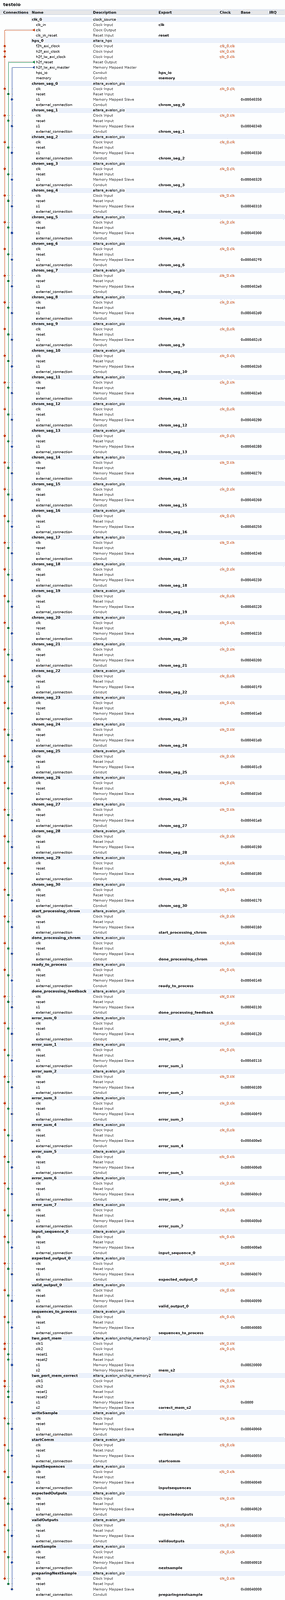
[diagram p0: system contents, whole]
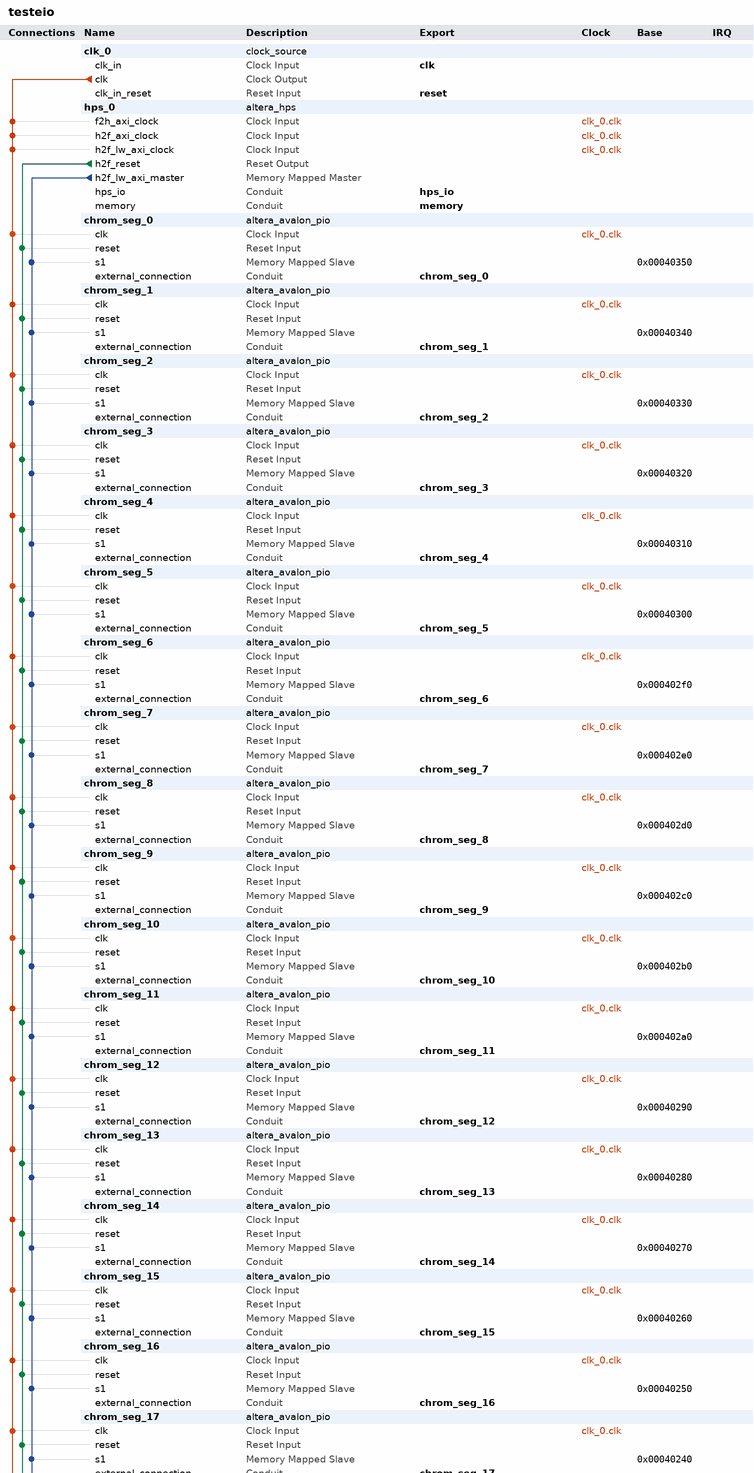
[diagram p1: system contents, upper part]
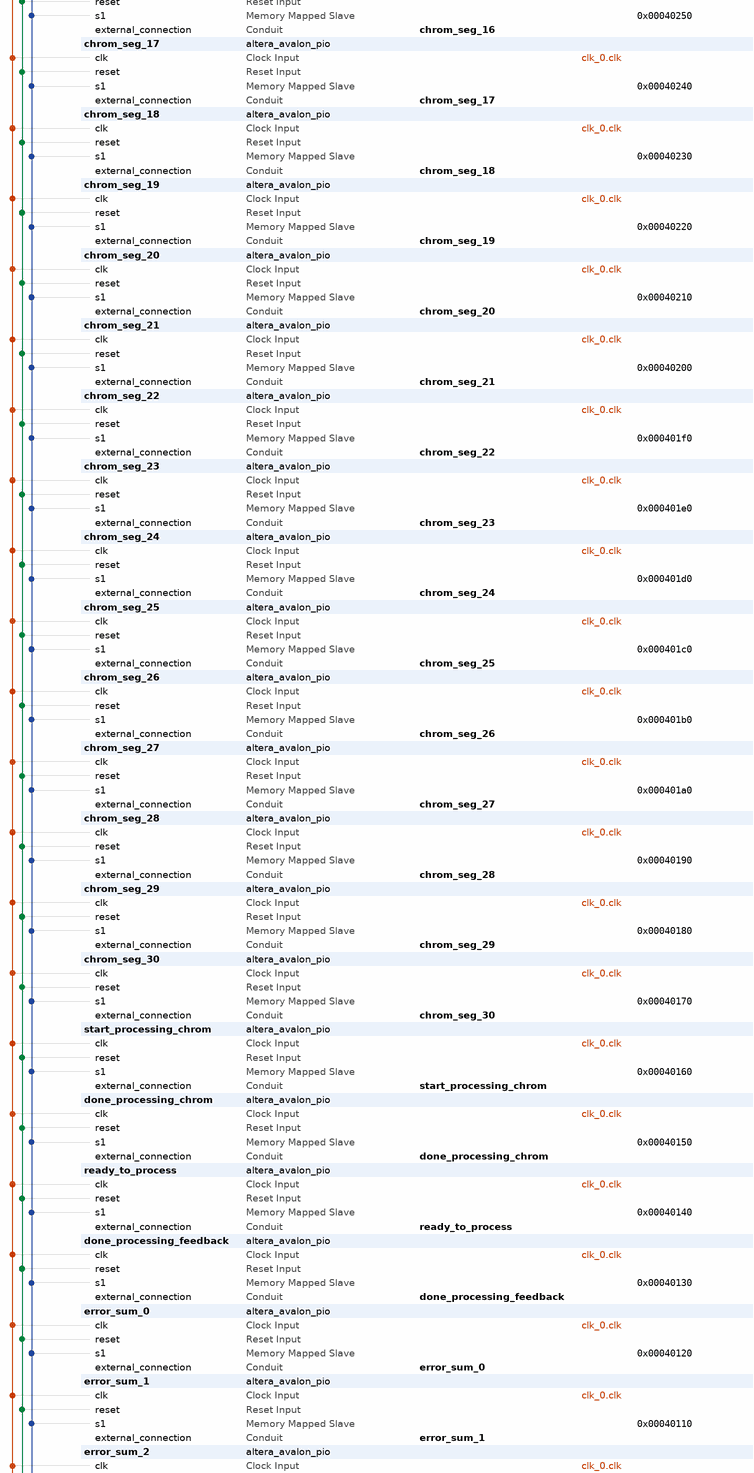
[diagram p2: system contents, middle part]
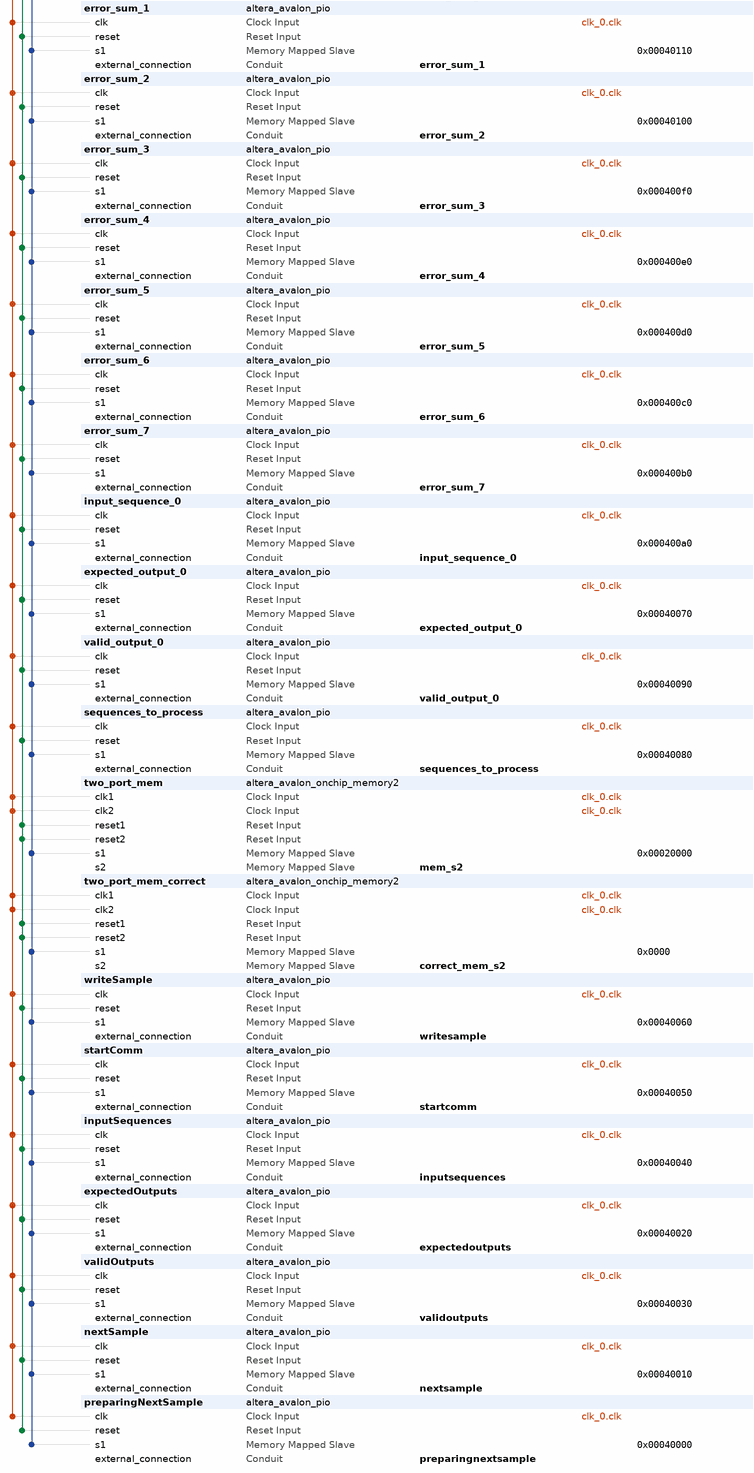
[diagram p3: system contents, lower part]
# Platform Designer (Qsys) system testeio, Cyclone V 5CSEMA5F31C6
# Parameters at their usual value, and those the tool derives, are not listed.
package require -exact qsys 16.1
create_system testeio
set_project_property DEVICE_FAMILY {Cyclone V}
set_project_property DEVICE 5CSEMA5F31C6

add_instance clk_0 clock_source 16.1
set_instance_parameter_value clk_0 clockFrequency 50000000

add_instance hps_0 altera_hps 16.1
set_instance_parameter_value hps_0 EMAC1_Mode RGMII
set_instance_parameter_value hps_0 EMAC1_PinMuxing {HPS I/O Set 0}
set_instance_parameter_value hps_0 F2SCLK_COLDRST_Enable false
set_instance_parameter_value hps_0 F2SCLK_DBGRST_Enable false
set_instance_parameter_value hps_0 F2SCLK_WARMRST_Enable false
set_instance_parameter_value hps_0 F2SINTERRUPT_Enable false
set_instance_parameter_value hps_0 F2S_Width 2
set_instance_parameter_value hps_0 FPGA_PERIPHERAL_OUTPUT_CLOCK_FREQ_EMAC0_GTX_CLK 125
set_instance_parameter_value hps_0 FPGA_PERIPHERAL_OUTPUT_CLOCK_FREQ_EMAC0_MD_CLK 2.5
set_instance_parameter_value hps_0 FPGA_PERIPHERAL_OUTPUT_CLOCK_FREQ_EMAC1_GTX_CLK 125
set_instance_parameter_value hps_0 FPGA_PERIPHERAL_OUTPUT_CLOCK_FREQ_EMAC1_MD_CLK 2.5
set_instance_parameter_value hps_0 HPS_PROTOCOL DDR3
set_instance_parameter_value hps_0 I2C0_Mode N/A
set_instance_parameter_value hps_0 I2C0_PinMuxing Unused
set_instance_parameter_value hps_0 I2C1_Mode N/A
set_instance_parameter_value hps_0 I2C1_PinMuxing Unused
set_instance_parameter_value hps_0 LWH2F_Enable true
set_instance_parameter_value hps_0 MEM_BANKADDR_WIDTH 3
set_instance_parameter_value hps_0 MEM_CLK_FREQ 400.0
set_instance_parameter_value hps_0 MEM_COL_ADDR_WIDTH 10
set_instance_parameter_value hps_0 MEM_DQ_WIDTH 32
set_instance_parameter_value hps_0 MEM_DRV_STR RZQ/7
set_instance_parameter_value hps_0 MEM_ROW_ADDR_WIDTH 15
set_instance_parameter_value hps_0 MEM_RTT_NOM RZQ/4
set_instance_parameter_value hps_0 MEM_RTT_WR {Dynamic ODT off}
set_instance_parameter_value hps_0 MEM_TCL 11
set_instance_parameter_value hps_0 MEM_TFAW_NS 30.0
set_instance_parameter_value hps_0 MEM_TRAS_NS 35.0
set_instance_parameter_value hps_0 MEM_TRCD_NS 13.75
set_instance_parameter_value hps_0 MEM_TRFC_NS 260.0
set_instance_parameter_value hps_0 MEM_TRP_NS 13.75
set_instance_parameter_value hps_0 MEM_VENDOR JEDEC
set_instance_parameter_value hps_0 MEM_WTCL 8
set_instance_parameter_value hps_0 QSPI_Mode N/A
set_instance_parameter_value hps_0 QSPI_PinMuxing Unused
set_instance_parameter_value hps_0 REF_CLK_FREQ 25.0
set_instance_parameter_value hps_0 S2FCLK_USER2CLK 5
set_instance_parameter_value hps_0 S2F_Width 2
set_instance_parameter_value hps_0 SDIO_Mode {4-bit Data}
set_instance_parameter_value hps_0 SDIO_PinMuxing {HPS I/O Set 0}
set_instance_parameter_value hps_0 SPIM1_Mode N/A
set_instance_parameter_value hps_0 SPIM1_PinMuxing Unused
set_instance_parameter_value hps_0 STM_Enable false
set_instance_parameter_value hps_0 TIMING_BOARD_AC_SKEW 0.03
set_instance_parameter_value hps_0 TIMING_BOARD_AC_TO_CK_SKEW 0.0
set_instance_parameter_value hps_0 TIMING_BOARD_DQ_TO_DQS_SKEW 0.0
set_instance_parameter_value hps_0 TIMING_BOARD_MAX_CK_DELAY 0.03
set_instance_parameter_value hps_0 TIMING_BOARD_MAX_DQS_DELAY 0.02
set_instance_parameter_value hps_0 TIMING_BOARD_SKEW_BETWEEN_DQS 0.08
set_instance_parameter_value hps_0 TIMING_BOARD_SKEW_CKDQS_DIMM_MAX 0.16
set_instance_parameter_value hps_0 TIMING_BOARD_SKEW_CKDQS_DIMM_MIN 0.09
set_instance_parameter_value hps_0 TIMING_BOARD_SKEW_WITHIN_DQS 0.01
set_instance_parameter_value hps_0 TIMING_TDH 65
set_instance_parameter_value hps_0 TIMING_TDQSCK 255
set_instance_parameter_value hps_0 TIMING_TDQSQ 125
set_instance_parameter_value hps_0 TIMING_TDS 30
set_instance_parameter_value hps_0 TIMING_TIH 140
set_instance_parameter_value hps_0 TIMING_TIS 180
set_instance_parameter_value hps_0 TIMING_TQSH 0.4
set_instance_parameter_value hps_0 UART0_Mode {No Flow Control}
set_instance_parameter_value hps_0 UART0_PinMuxing {HPS I/O Set 0}
set_instance_parameter_value hps_0 USB1_Mode SDR
set_instance_parameter_value hps_0 USB1_PinMuxing {HPS I/O Set 0}
set_instance_parameter_value hps_0 desired_cfg_clk_mhz 100.0
set_instance_parameter_value hps_0 desired_qspi_clk_mhz 400.0

add_instance chrom_seg_0 altera_avalon_pio 16.1
set_instance_parameter_value chrom_seg_0 direction Output
set_instance_parameter_value chrom_seg_0 width 32

add_instance chrom_seg_1 altera_avalon_pio 16.1
set_instance_parameter_value chrom_seg_1 direction Output
set_instance_parameter_value chrom_seg_1 width 32

add_instance chrom_seg_2 altera_avalon_pio 16.1
set_instance_parameter_value chrom_seg_2 direction Output
set_instance_parameter_value chrom_seg_2 width 32

add_instance chrom_seg_3 altera_avalon_pio 16.1
set_instance_parameter_value chrom_seg_3 direction Output
set_instance_parameter_value chrom_seg_3 width 32

add_instance chrom_seg_4 altera_avalon_pio 16.1
set_instance_parameter_value chrom_seg_4 direction Output
set_instance_parameter_value chrom_seg_4 width 32

add_instance chrom_seg_5 altera_avalon_pio 16.1
set_instance_parameter_value chrom_seg_5 direction Output
set_instance_parameter_value chrom_seg_5 width 32

add_instance chrom_seg_6 altera_avalon_pio 16.1
set_instance_parameter_value chrom_seg_6 direction Output
set_instance_parameter_value chrom_seg_6 width 32

add_instance chrom_seg_7 altera_avalon_pio 16.1
set_instance_parameter_value chrom_seg_7 direction Output
set_instance_parameter_value chrom_seg_7 width 32

add_instance chrom_seg_8 altera_avalon_pio 16.1
set_instance_parameter_value chrom_seg_8 direction Output
set_instance_parameter_value chrom_seg_8 width 32

add_instance chrom_seg_9 altera_avalon_pio 16.1
set_instance_parameter_value chrom_seg_9 direction Output
set_instance_parameter_value chrom_seg_9 width 32

add_instance chrom_seg_10 altera_avalon_pio 16.1
set_instance_parameter_value chrom_seg_10 direction Output
set_instance_parameter_value chrom_seg_10 width 32

add_instance chrom_seg_11 altera_avalon_pio 16.1
set_instance_parameter_value chrom_seg_11 direction Output
set_instance_parameter_value chrom_seg_11 width 32

add_instance chrom_seg_12 altera_avalon_pio 16.1
set_instance_parameter_value chrom_seg_12 direction Output
set_instance_parameter_value chrom_seg_12 width 32

add_instance chrom_seg_13 altera_avalon_pio 16.1
set_instance_parameter_value chrom_seg_13 direction Output
set_instance_parameter_value chrom_seg_13 width 32

add_instance chrom_seg_14 altera_avalon_pio 16.1
set_instance_parameter_value chrom_seg_14 direction Output
set_instance_parameter_value chrom_seg_14 width 32

add_instance chrom_seg_15 altera_avalon_pio 16.1
set_instance_parameter_value chrom_seg_15 direction Output
set_instance_parameter_value chrom_seg_15 width 32

add_instance chrom_seg_16 altera_avalon_pio 16.1
set_instance_parameter_value chrom_seg_16 direction Output
set_instance_parameter_value chrom_seg_16 width 32

add_instance chrom_seg_17 altera_avalon_pio 16.1
set_instance_parameter_value chrom_seg_17 direction Output
set_instance_parameter_value chrom_seg_17 width 32

add_instance chrom_seg_18 altera_avalon_pio 16.1
set_instance_parameter_value chrom_seg_18 direction Output
set_instance_parameter_value chrom_seg_18 width 32

add_instance chrom_seg_19 altera_avalon_pio 16.1
set_instance_parameter_value chrom_seg_19 direction Output
set_instance_parameter_value chrom_seg_19 width 32

add_instance chrom_seg_20 altera_avalon_pio 16.1
set_instance_parameter_value chrom_seg_20 direction Output
set_instance_parameter_value chrom_seg_20 width 32

add_instance chrom_seg_21 altera_avalon_pio 16.1
set_instance_parameter_value chrom_seg_21 direction Output
set_instance_parameter_value chrom_seg_21 width 32

add_instance chrom_seg_22 altera_avalon_pio 16.1
set_instance_parameter_value chrom_seg_22 direction Output
set_instance_parameter_value chrom_seg_22 width 32

add_instance chrom_seg_23 altera_avalon_pio 16.1
set_instance_parameter_value chrom_seg_23 direction Output
set_instance_parameter_value chrom_seg_23 width 32

add_instance chrom_seg_24 altera_avalon_pio 16.1
set_instance_parameter_value chrom_seg_24 direction Output
set_instance_parameter_value chrom_seg_24 width 32

add_instance chrom_seg_25 altera_avalon_pio 16.1
set_instance_parameter_value chrom_seg_25 direction Output
set_instance_parameter_value chrom_seg_25 width 32

add_instance chrom_seg_26 altera_avalon_pio 16.1
set_instance_parameter_value chrom_seg_26 direction Output
set_instance_parameter_value chrom_seg_26 width 32

add_instance chrom_seg_27 altera_avalon_pio 16.1
set_instance_parameter_value chrom_seg_27 direction Output
set_instance_parameter_value chrom_seg_27 width 32

add_instance chrom_seg_28 altera_avalon_pio 16.1
set_instance_parameter_value chrom_seg_28 direction Output
set_instance_parameter_value chrom_seg_28 width 32

add_instance chrom_seg_29 altera_avalon_pio 16.1
set_instance_parameter_value chrom_seg_29 direction Output
set_instance_parameter_value chrom_seg_29 width 32

add_instance chrom_seg_30 altera_avalon_pio 16.1
set_instance_parameter_value chrom_seg_30 direction Output
set_instance_parameter_value chrom_seg_30 width 32

add_instance start_processing_chrom altera_avalon_pio 16.1
set_instance_parameter_value start_processing_chrom direction Output
set_instance_parameter_value start_processing_chrom width 1

add_instance done_processing_chrom altera_avalon_pio 16.1
set_instance_parameter_value done_processing_chrom direction Input
set_instance_parameter_value done_processing_chrom width 1

add_instance ready_to_process altera_avalon_pio 16.1
set_instance_parameter_value ready_to_process direction Input
set_instance_parameter_value ready_to_process width 1

add_instance done_processing_feedback altera_avalon_pio 16.1
set_instance_parameter_value done_processing_feedback direction Output
set_instance_parameter_value done_processing_feedback width 1

add_instance error_sum_0 altera_avalon_pio 16.1
set_instance_parameter_value error_sum_0 direction Input
set_instance_parameter_value error_sum_0 width 32

add_instance error_sum_1 altera_avalon_pio 16.1
set_instance_parameter_value error_sum_1 direction Input
set_instance_parameter_value error_sum_1 width 32

add_instance error_sum_2 altera_avalon_pio 16.1
set_instance_parameter_value error_sum_2 direction Input
set_instance_parameter_value error_sum_2 width 32

add_instance error_sum_3 altera_avalon_pio 16.1
set_instance_parameter_value error_sum_3 direction Input
set_instance_parameter_value error_sum_3 width 32

add_instance error_sum_4 altera_avalon_pio 16.1
set_instance_parameter_value error_sum_4 direction Input
set_instance_parameter_value error_sum_4 width 32

add_instance error_sum_5 altera_avalon_pio 16.1
set_instance_parameter_value error_sum_5 direction Input
set_instance_parameter_value error_sum_5 width 32

add_instance error_sum_6 altera_avalon_pio 16.1
set_instance_parameter_value error_sum_6 direction Input
set_instance_parameter_value error_sum_6 width 32

add_instance error_sum_7 altera_avalon_pio 16.1
set_instance_parameter_value error_sum_7 direction Input
set_instance_parameter_value error_sum_7 width 32

add_instance input_sequence_0 altera_avalon_pio 16.1
set_instance_parameter_value input_sequence_0 direction Output
set_instance_parameter_value input_sequence_0 width 32

add_instance expected_output_0 altera_avalon_pio 16.1
set_instance_parameter_value expected_output_0 direction Output
set_instance_parameter_value expected_output_0 width 32

add_instance valid_output_0 altera_avalon_pio 16.1
set_instance_parameter_value valid_output_0 direction Output
set_instance_parameter_value valid_output_0 width 32

add_instance sequences_to_process altera_avalon_pio 16.1
set_instance_parameter_value sequences_to_process direction Output
set_instance_parameter_value sequences_to_process width 32

add_instance two_port_mem altera_avalon_onchip_memory2 16.1
set_instance_parameter_value two_port_mem dataWidth 32
set_instance_parameter_value two_port_mem dualPort true
set_instance_parameter_value two_port_mem initMemContent true
set_instance_parameter_value two_port_mem initializationFileName onchip_mem.hex
set_instance_parameter_value two_port_mem memorySize 131072

add_instance two_port_mem_correct altera_avalon_onchip_memory2 16.1
set_instance_parameter_value two_port_mem_correct dataWidth 32
set_instance_parameter_value two_port_mem_correct dualPort true
set_instance_parameter_value two_port_mem_correct initMemContent true
set_instance_parameter_value two_port_mem_correct initializationFileName onchip_mem.hex
set_instance_parameter_value two_port_mem_correct memorySize 131072

add_instance writeSample altera_avalon_pio 16.1
set_instance_parameter_value writeSample direction Output
set_instance_parameter_value writeSample width 32

add_instance startComm altera_avalon_pio 16.1
set_instance_parameter_value startComm direction Output
set_instance_parameter_value startComm width 32

add_instance inputSequences altera_avalon_pio 16.1
set_instance_parameter_value inputSequences direction Input
set_instance_parameter_value inputSequences width 32

add_instance expectedOutputs altera_avalon_pio 16.1
set_instance_parameter_value expectedOutputs direction Input
set_instance_parameter_value expectedOutputs width 32

add_instance validOutputs altera_avalon_pio 16.1
set_instance_parameter_value validOutputs direction Input
set_instance_parameter_value validOutputs width 32

add_instance nextSample altera_avalon_pio 16.1
set_instance_parameter_value nextSample direction Input
set_instance_parameter_value nextSample width 32

add_instance preparingNextSample altera_avalon_pio 16.1
set_instance_parameter_value preparingNextSample direction Output
set_instance_parameter_value preparingNextSample width 32

# connections
add_connection clk_0.clk chrom_seg_0.clk clock
add_connection clk_0.clk chrom_seg_1.clk clock
add_connection clk_0.clk chrom_seg_2.clk clock
add_connection clk_0.clk chrom_seg_3.clk clock
add_connection clk_0.clk chrom_seg_4.clk clock
add_connection clk_0.clk chrom_seg_5.clk clock
add_connection clk_0.clk chrom_seg_6.clk clock
add_connection clk_0.clk chrom_seg_7.clk clock
add_connection clk_0.clk chrom_seg_8.clk clock
add_connection clk_0.clk chrom_seg_9.clk clock
add_connection clk_0.clk chrom_seg_10.clk clock
add_connection clk_0.clk chrom_seg_11.clk clock
add_connection clk_0.clk chrom_seg_12.clk clock
add_connection clk_0.clk chrom_seg_13.clk clock
add_connection clk_0.clk chrom_seg_14.clk clock
add_connection clk_0.clk chrom_seg_15.clk clock
add_connection clk_0.clk chrom_seg_16.clk clock
add_connection clk_0.clk chrom_seg_17.clk clock
add_connection clk_0.clk chrom_seg_18.clk clock
add_connection clk_0.clk chrom_seg_19.clk clock
add_connection clk_0.clk chrom_seg_20.clk clock
add_connection clk_0.clk chrom_seg_21.clk clock
add_connection clk_0.clk chrom_seg_22.clk clock
add_connection clk_0.clk chrom_seg_23.clk clock
add_connection clk_0.clk chrom_seg_24.clk clock
add_connection clk_0.clk chrom_seg_25.clk clock
add_connection clk_0.clk chrom_seg_26.clk clock
add_connection clk_0.clk chrom_seg_27.clk clock
add_connection clk_0.clk chrom_seg_28.clk clock
add_connection clk_0.clk chrom_seg_29.clk clock
add_connection clk_0.clk chrom_seg_30.clk clock
add_connection clk_0.clk done_processing_chrom.clk clock
add_connection clk_0.clk done_processing_feedback.clk clock
add_connection clk_0.clk error_sum_0.clk clock
add_connection clk_0.clk error_sum_1.clk clock
add_connection clk_0.clk error_sum_2.clk clock
add_connection clk_0.clk error_sum_3.clk clock
add_connection clk_0.clk error_sum_4.clk clock
add_connection clk_0.clk error_sum_5.clk clock
add_connection clk_0.clk error_sum_6.clk clock
add_connection clk_0.clk error_sum_7.clk clock
add_connection clk_0.clk expected_output_0.clk clock
add_connection clk_0.clk expectedOutputs.clk clock
add_connection clk_0.clk hps_0.f2h_axi_clock clock
add_connection clk_0.clk hps_0.h2f_axi_clock clock
add_connection clk_0.clk hps_0.h2f_lw_axi_clock clock
add_connection clk_0.clk input_sequence_0.clk clock
add_connection clk_0.clk inputSequences.clk clock
add_connection clk_0.clk nextSample.clk clock
add_connection clk_0.clk preparingNextSample.clk clock
add_connection clk_0.clk ready_to_process.clk clock
add_connection clk_0.clk sequences_to_process.clk clock
add_connection clk_0.clk start_processing_chrom.clk clock
add_connection clk_0.clk startComm.clk clock
add_connection clk_0.clk two_port_mem.clk1 clock
add_connection clk_0.clk two_port_mem.clk2 clock
add_connection clk_0.clk two_port_mem_correct.clk1 clock
add_connection clk_0.clk two_port_mem_correct.clk2 clock
add_connection clk_0.clk valid_output_0.clk clock
add_connection clk_0.clk validOutputs.clk clock
add_connection clk_0.clk writeSample.clk clock
add_connection hps_0.h2f_reset chrom_seg_0.reset reset
add_connection hps_0.h2f_reset chrom_seg_1.reset reset
add_connection hps_0.h2f_reset chrom_seg_2.reset reset
add_connection hps_0.h2f_reset chrom_seg_3.reset reset
add_connection hps_0.h2f_reset chrom_seg_4.reset reset
add_connection hps_0.h2f_reset chrom_seg_5.reset reset
add_connection hps_0.h2f_reset chrom_seg_6.reset reset
add_connection hps_0.h2f_reset chrom_seg_7.reset reset
add_connection hps_0.h2f_reset chrom_seg_8.reset reset
add_connection hps_0.h2f_reset chrom_seg_9.reset reset
add_connection hps_0.h2f_reset chrom_seg_10.reset reset
add_connection hps_0.h2f_reset chrom_seg_11.reset reset
add_connection hps_0.h2f_reset chrom_seg_12.reset reset
add_connection hps_0.h2f_reset chrom_seg_13.reset reset
add_connection hps_0.h2f_reset chrom_seg_14.reset reset
add_connection hps_0.h2f_reset chrom_seg_15.reset reset
add_connection hps_0.h2f_reset chrom_seg_16.reset reset
add_connection hps_0.h2f_reset chrom_seg_17.reset reset
add_connection hps_0.h2f_reset chrom_seg_18.reset reset
add_connection hps_0.h2f_reset chrom_seg_19.reset reset
add_connection hps_0.h2f_reset chrom_seg_20.reset reset
add_connection hps_0.h2f_reset chrom_seg_21.reset reset
add_connection hps_0.h2f_reset chrom_seg_22.reset reset
add_connection hps_0.h2f_reset chrom_seg_23.reset reset
add_connection hps_0.h2f_reset chrom_seg_24.reset reset
add_connection hps_0.h2f_reset chrom_seg_25.reset reset
add_connection hps_0.h2f_reset chrom_seg_26.reset reset
add_connection hps_0.h2f_reset chrom_seg_27.reset reset
add_connection hps_0.h2f_reset chrom_seg_28.reset reset
add_connection hps_0.h2f_reset chrom_seg_29.reset reset
add_connection hps_0.h2f_reset chrom_seg_30.reset reset
add_connection hps_0.h2f_reset done_processing_chrom.reset reset
add_connection hps_0.h2f_reset done_processing_feedback.reset reset
add_connection hps_0.h2f_reset error_sum_0.reset reset
add_connection hps_0.h2f_reset error_sum_1.reset reset
add_connection hps_0.h2f_reset error_sum_2.reset reset
add_connection hps_0.h2f_reset error_sum_3.reset reset
add_connection hps_0.h2f_reset error_sum_4.reset reset
add_connection hps_0.h2f_reset error_sum_5.reset reset
add_connection hps_0.h2f_reset error_sum_6.reset reset
add_connection hps_0.h2f_reset error_sum_7.reset reset
add_connection hps_0.h2f_reset expected_output_0.reset reset
add_connection hps_0.h2f_reset expectedOutputs.reset reset
add_connection hps_0.h2f_reset input_sequence_0.reset reset
add_connection hps_0.h2f_reset inputSequences.reset reset
add_connection hps_0.h2f_reset nextSample.reset reset
add_connection hps_0.h2f_reset preparingNextSample.reset reset
add_connection hps_0.h2f_reset ready_to_process.reset reset
add_connection hps_0.h2f_reset sequences_to_process.reset reset
add_connection hps_0.h2f_reset start_processing_chrom.reset reset
add_connection hps_0.h2f_reset startComm.reset reset
add_connection hps_0.h2f_reset two_port_mem.reset1 reset
add_connection hps_0.h2f_reset two_port_mem.reset2 reset
add_connection hps_0.h2f_reset two_port_mem_correct.reset1 reset
add_connection hps_0.h2f_reset two_port_mem_correct.reset2 reset
add_connection hps_0.h2f_reset valid_output_0.reset reset
add_connection hps_0.h2f_reset validOutputs.reset reset
add_connection hps_0.h2f_reset writeSample.reset reset
add_connection hps_0.h2f_lw_axi_master chrom_seg_0.s1 avalon
set_connection_parameter_value hps_0.h2f_lw_axi_master/chrom_seg_0.s1 baseAddress 0x00040350
add_connection hps_0.h2f_lw_axi_master chrom_seg_1.s1 avalon
set_connection_parameter_value hps_0.h2f_lw_axi_master/chrom_seg_1.s1 baseAddress 0x00040340
add_connection hps_0.h2f_lw_axi_master chrom_seg_2.s1 avalon
set_connection_parameter_value hps_0.h2f_lw_axi_master/chrom_seg_2.s1 baseAddress 0x00040330
add_connection hps_0.h2f_lw_axi_master chrom_seg_3.s1 avalon
set_connection_parameter_value hps_0.h2f_lw_axi_master/chrom_seg_3.s1 baseAddress 0x00040320
add_connection hps_0.h2f_lw_axi_master chrom_seg_4.s1 avalon
set_connection_parameter_value hps_0.h2f_lw_axi_master/chrom_seg_4.s1 baseAddress 0x00040310
add_connection hps_0.h2f_lw_axi_master chrom_seg_5.s1 avalon
set_connection_parameter_value hps_0.h2f_lw_axi_master/chrom_seg_5.s1 baseAddress 0x00040300
add_connection hps_0.h2f_lw_axi_master chrom_seg_6.s1 avalon
set_connection_parameter_value hps_0.h2f_lw_axi_master/chrom_seg_6.s1 baseAddress 0x000402f0
add_connection hps_0.h2f_lw_axi_master chrom_seg_7.s1 avalon
set_connection_parameter_value hps_0.h2f_lw_axi_master/chrom_seg_7.s1 baseAddress 0x000402e0
add_connection hps_0.h2f_lw_axi_master chrom_seg_8.s1 avalon
set_connection_parameter_value hps_0.h2f_lw_axi_master/chrom_seg_8.s1 baseAddress 0x000402d0
add_connection hps_0.h2f_lw_axi_master chrom_seg_9.s1 avalon
set_connection_parameter_value hps_0.h2f_lw_axi_master/chrom_seg_9.s1 baseAddress 0x000402c0
add_connection hps_0.h2f_lw_axi_master chrom_seg_10.s1 avalon
set_connection_parameter_value hps_0.h2f_lw_axi_master/chrom_seg_10.s1 baseAddress 0x000402b0
add_connection hps_0.h2f_lw_axi_master chrom_seg_11.s1 avalon
set_connection_parameter_value hps_0.h2f_lw_axi_master/chrom_seg_11.s1 baseAddress 0x000402a0
add_connection hps_0.h2f_lw_axi_master chrom_seg_12.s1 avalon
set_connection_parameter_value hps_0.h2f_lw_axi_master/chrom_seg_12.s1 baseAddress 0x00040290
add_connection hps_0.h2f_lw_axi_master chrom_seg_13.s1 avalon
set_connection_parameter_value hps_0.h2f_lw_axi_master/chrom_seg_13.s1 baseAddress 0x00040280
add_connection hps_0.h2f_lw_axi_master chrom_seg_14.s1 avalon
set_connection_parameter_value hps_0.h2f_lw_axi_master/chrom_seg_14.s1 baseAddress 0x00040270
add_connection hps_0.h2f_lw_axi_master chrom_seg_15.s1 avalon
set_connection_parameter_value hps_0.h2f_lw_axi_master/chrom_seg_15.s1 baseAddress 0x00040260
add_connection hps_0.h2f_lw_axi_master chrom_seg_16.s1 avalon
set_connection_parameter_value hps_0.h2f_lw_axi_master/chrom_seg_16.s1 baseAddress 0x00040250
add_connection hps_0.h2f_lw_axi_master chrom_seg_17.s1 avalon
set_connection_parameter_value hps_0.h2f_lw_axi_master/chrom_seg_17.s1 baseAddress 0x00040240
add_connection hps_0.h2f_lw_axi_master chrom_seg_18.s1 avalon
set_connection_parameter_value hps_0.h2f_lw_axi_master/chrom_seg_18.s1 baseAddress 0x00040230
add_connection hps_0.h2f_lw_axi_master chrom_seg_19.s1 avalon
set_connection_parameter_value hps_0.h2f_lw_axi_master/chrom_seg_19.s1 baseAddress 0x00040220
add_connection hps_0.h2f_lw_axi_master chrom_seg_20.s1 avalon
set_connection_parameter_value hps_0.h2f_lw_axi_master/chrom_seg_20.s1 baseAddress 0x00040210
add_connection hps_0.h2f_lw_axi_master chrom_seg_21.s1 avalon
set_connection_parameter_value hps_0.h2f_lw_axi_master/chrom_seg_21.s1 baseAddress 0x00040200
add_connection hps_0.h2f_lw_axi_master chrom_seg_22.s1 avalon
set_connection_parameter_value hps_0.h2f_lw_axi_master/chrom_seg_22.s1 baseAddress 0x000401f0
add_connection hps_0.h2f_lw_axi_master chrom_seg_23.s1 avalon
set_connection_parameter_value hps_0.h2f_lw_axi_master/chrom_seg_23.s1 baseAddress 0x000401e0
add_connection hps_0.h2f_lw_axi_master chrom_seg_24.s1 avalon
set_connection_parameter_value hps_0.h2f_lw_axi_master/chrom_seg_24.s1 baseAddress 0x000401d0
add_connection hps_0.h2f_lw_axi_master chrom_seg_25.s1 avalon
set_connection_parameter_value hps_0.h2f_lw_axi_master/chrom_seg_25.s1 baseAddress 0x000401c0
add_connection hps_0.h2f_lw_axi_master chrom_seg_26.s1 avalon
set_connection_parameter_value hps_0.h2f_lw_axi_master/chrom_seg_26.s1 baseAddress 0x000401b0
add_connection hps_0.h2f_lw_axi_master chrom_seg_27.s1 avalon
set_connection_parameter_value hps_0.h2f_lw_axi_master/chrom_seg_27.s1 baseAddress 0x000401a0
add_connection hps_0.h2f_lw_axi_master chrom_seg_28.s1 avalon
set_connection_parameter_value hps_0.h2f_lw_axi_master/chrom_seg_28.s1 baseAddress 0x00040190
add_connection hps_0.h2f_lw_axi_master chrom_seg_29.s1 avalon
set_connection_parameter_value hps_0.h2f_lw_axi_master/chrom_seg_29.s1 baseAddress 0x00040180
add_connection hps_0.h2f_lw_axi_master chrom_seg_30.s1 avalon
set_connection_parameter_value hps_0.h2f_lw_axi_master/chrom_seg_30.s1 baseAddress 0x00040170
add_connection hps_0.h2f_lw_axi_master done_processing_chrom.s1 avalon
set_connection_parameter_value hps_0.h2f_lw_axi_master/done_processing_chrom.s1 baseAddress 0x00040150
add_connection hps_0.h2f_lw_axi_master done_processing_feedback.s1 avalon
set_connection_parameter_value hps_0.h2f_lw_axi_master/done_processing_feedback.s1 baseAddress 0x00040130
add_connection hps_0.h2f_lw_axi_master error_sum_0.s1 avalon
set_connection_parameter_value hps_0.h2f_lw_axi_master/error_sum_0.s1 baseAddress 0x00040120
add_connection hps_0.h2f_lw_axi_master error_sum_1.s1 avalon
set_connection_parameter_value hps_0.h2f_lw_axi_master/error_sum_1.s1 baseAddress 0x00040110
add_connection hps_0.h2f_lw_axi_master error_sum_2.s1 avalon
set_connection_parameter_value hps_0.h2f_lw_axi_master/error_sum_2.s1 baseAddress 0x00040100
add_connection hps_0.h2f_lw_axi_master error_sum_3.s1 avalon
set_connection_parameter_value hps_0.h2f_lw_axi_master/error_sum_3.s1 baseAddress 0x000400f0
add_connection hps_0.h2f_lw_axi_master error_sum_4.s1 avalon
set_connection_parameter_value hps_0.h2f_lw_axi_master/error_sum_4.s1 baseAddress 0x000400e0
add_connection hps_0.h2f_lw_axi_master error_sum_5.s1 avalon
set_connection_parameter_value hps_0.h2f_lw_axi_master/error_sum_5.s1 baseAddress 0x000400d0
add_connection hps_0.h2f_lw_axi_master error_sum_6.s1 avalon
set_connection_parameter_value hps_0.h2f_lw_axi_master/error_sum_6.s1 baseAddress 0x000400c0
add_connection hps_0.h2f_lw_axi_master error_sum_7.s1 avalon
set_connection_parameter_value hps_0.h2f_lw_axi_master/error_sum_7.s1 baseAddress 0x000400b0
add_connection hps_0.h2f_lw_axi_master expected_output_0.s1 avalon
set_connection_parameter_value hps_0.h2f_lw_axi_master/expected_output_0.s1 baseAddress 0x00040070
add_connection hps_0.h2f_lw_axi_master expectedOutputs.s1 avalon
set_connection_parameter_value hps_0.h2f_lw_axi_master/expectedOutputs.s1 baseAddress 0x00040020
add_connection hps_0.h2f_lw_axi_master input_sequence_0.s1 avalon
set_connection_parameter_value hps_0.h2f_lw_axi_master/input_sequence_0.s1 baseAddress 0x000400a0
add_connection hps_0.h2f_lw_axi_master inputSequences.s1 avalon
set_connection_parameter_value hps_0.h2f_lw_axi_master/inputSequences.s1 baseAddress 0x00040040
add_connection hps_0.h2f_lw_axi_master nextSample.s1 avalon
set_connection_parameter_value hps_0.h2f_lw_axi_master/nextSample.s1 baseAddress 0x00040010
add_connection hps_0.h2f_lw_axi_master preparingNextSample.s1 avalon
set_connection_parameter_value hps_0.h2f_lw_axi_master/preparingNextSample.s1 baseAddress 0x00040000
add_connection hps_0.h2f_lw_axi_master ready_to_process.s1 avalon
set_connection_parameter_value hps_0.h2f_lw_axi_master/ready_to_process.s1 baseAddress 0x00040140
add_connection hps_0.h2f_lw_axi_master sequences_to_process.s1 avalon
set_connection_parameter_value hps_0.h2f_lw_axi_master/sequences_to_process.s1 baseAddress 0x00040080
add_connection hps_0.h2f_lw_axi_master start_processing_chrom.s1 avalon
set_connection_parameter_value hps_0.h2f_lw_axi_master/start_processing_chrom.s1 baseAddress 0x00040160
add_connection hps_0.h2f_lw_axi_master startComm.s1 avalon
set_connection_parameter_value hps_0.h2f_lw_axi_master/startComm.s1 baseAddress 0x00040050
add_connection hps_0.h2f_lw_axi_master two_port_mem.s1 avalon
set_connection_parameter_value hps_0.h2f_lw_axi_master/two_port_mem.s1 baseAddress 0x00020000
add_connection hps_0.h2f_lw_axi_master two_port_mem_correct.s1 avalon
set_connection_parameter_value hps_0.h2f_lw_axi_master/two_port_mem_correct.s1 baseAddress 0x0000
add_connection hps_0.h2f_lw_axi_master valid_output_0.s1 avalon
set_connection_parameter_value hps_0.h2f_lw_axi_master/valid_output_0.s1 baseAddress 0x00040090
add_connection hps_0.h2f_lw_axi_master validOutputs.s1 avalon
set_connection_parameter_value hps_0.h2f_lw_axi_master/validOutputs.s1 baseAddress 0x00040030
add_connection hps_0.h2f_lw_axi_master writeSample.s1 avalon
set_connection_parameter_value hps_0.h2f_lw_axi_master/writeSample.s1 baseAddress 0x00040060

# exported interfaces
add_interface chrom_seg_0 conduit end
set_interface_property chrom_seg_0 EXPORT_OF chrom_seg_0.external_connection
add_interface chrom_seg_1 conduit end
set_interface_property chrom_seg_1 EXPORT_OF chrom_seg_1.external_connection
add_interface chrom_seg_10 conduit end
set_interface_property chrom_seg_10 EXPORT_OF chrom_seg_10.external_connection
add_interface chrom_seg_11 conduit end
set_interface_property chrom_seg_11 EXPORT_OF chrom_seg_11.external_connection
add_interface chrom_seg_12 conduit end
set_interface_property chrom_seg_12 EXPORT_OF chrom_seg_12.external_connection
add_interface chrom_seg_13 conduit end
set_interface_property chrom_seg_13 EXPORT_OF chrom_seg_13.external_connection
add_interface chrom_seg_14 conduit end
set_interface_property chrom_seg_14 EXPORT_OF chrom_seg_14.external_connection
add_interface chrom_seg_15 conduit end
set_interface_property chrom_seg_15 EXPORT_OF chrom_seg_15.external_connection
add_interface chrom_seg_16 conduit end
set_interface_property chrom_seg_16 EXPORT_OF chrom_seg_16.external_connection
add_interface chrom_seg_17 conduit end
set_interface_property chrom_seg_17 EXPORT_OF chrom_seg_17.external_connection
add_interface chrom_seg_18 conduit end
set_interface_property chrom_seg_18 EXPORT_OF chrom_seg_18.external_connection
add_interface chrom_seg_19 conduit end
set_interface_property chrom_seg_19 EXPORT_OF chrom_seg_19.external_connection
add_interface chrom_seg_2 conduit end
set_interface_property chrom_seg_2 EXPORT_OF chrom_seg_2.external_connection
add_interface chrom_seg_20 conduit end
set_interface_property chrom_seg_20 EXPORT_OF chrom_seg_20.external_connection
add_interface chrom_seg_21 conduit end
set_interface_property chrom_seg_21 EXPORT_OF chrom_seg_21.external_connection
add_interface chrom_seg_22 conduit end
set_interface_property chrom_seg_22 EXPORT_OF chrom_seg_22.external_connection
add_interface chrom_seg_23 conduit end
set_interface_property chrom_seg_23 EXPORT_OF chrom_seg_23.external_connection
add_interface chrom_seg_24 conduit end
set_interface_property chrom_seg_24 EXPORT_OF chrom_seg_24.external_connection
add_interface chrom_seg_25 conduit end
set_interface_property chrom_seg_25 EXPORT_OF chrom_seg_25.external_connection
add_interface chrom_seg_26 conduit end
set_interface_property chrom_seg_26 EXPORT_OF chrom_seg_26.external_connection
add_interface chrom_seg_27 conduit end
set_interface_property chrom_seg_27 EXPORT_OF chrom_seg_27.external_connection
add_interface chrom_seg_28 conduit end
set_interface_property chrom_seg_28 EXPORT_OF chrom_seg_28.external_connection
add_interface chrom_seg_29 conduit end
set_interface_property chrom_seg_29 EXPORT_OF chrom_seg_29.external_connection
add_interface chrom_seg_3 conduit end
set_interface_property chrom_seg_3 EXPORT_OF chrom_seg_3.external_connection
add_interface chrom_seg_30 conduit end
set_interface_property chrom_seg_30 EXPORT_OF chrom_seg_30.external_connection
add_interface chrom_seg_4 conduit end
set_interface_property chrom_seg_4 EXPORT_OF chrom_seg_4.external_connection
add_interface chrom_seg_5 conduit end
set_interface_property chrom_seg_5 EXPORT_OF chrom_seg_5.external_connection
add_interface chrom_seg_6 conduit end
set_interface_property chrom_seg_6 EXPORT_OF chrom_seg_6.external_connection
add_interface chrom_seg_7 conduit end
set_interface_property chrom_seg_7 EXPORT_OF chrom_seg_7.external_connection
add_interface chrom_seg_8 conduit end
set_interface_property chrom_seg_8 EXPORT_OF chrom_seg_8.external_connection
add_interface chrom_seg_9 conduit end
set_interface_property chrom_seg_9 EXPORT_OF chrom_seg_9.external_connection
add_interface clk clock sink
set_interface_property clk EXPORT_OF clk_0.clk_in
add_interface correct_mem_s2 avalon slave
set_interface_property correct_mem_s2 EXPORT_OF two_port_mem_correct.s2
add_interface done_processing_chrom conduit end
set_interface_property done_processing_chrom EXPORT_OF done_processing_chrom.external_connection
add_interface done_processing_feedback conduit end
set_interface_property done_processing_feedback EXPORT_OF done_processing_feedback.external_connection
add_interface error_sum_0 conduit end
set_interface_property error_sum_0 EXPORT_OF error_sum_0.external_connection
add_interface error_sum_1 conduit end
set_interface_property error_sum_1 EXPORT_OF error_sum_1.external_connection
add_interface error_sum_2 conduit end
set_interface_property error_sum_2 EXPORT_OF error_sum_2.external_connection
add_interface error_sum_3 conduit end
set_interface_property error_sum_3 EXPORT_OF error_sum_3.external_connection
add_interface error_sum_4 conduit end
set_interface_property error_sum_4 EXPORT_OF error_sum_4.external_connection
add_interface error_sum_5 conduit end
set_interface_property error_sum_5 EXPORT_OF error_sum_5.external_connection
add_interface error_sum_6 conduit end
set_interface_property error_sum_6 EXPORT_OF error_sum_6.external_connection
add_interface error_sum_7 conduit end
set_interface_property error_sum_7 EXPORT_OF error_sum_7.external_connection
add_interface expected_output_0 conduit end
set_interface_property expected_output_0 EXPORT_OF expected_output_0.external_connection
add_interface expectedoutputs conduit end
set_interface_property expectedoutputs EXPORT_OF expectedOutputs.external_connection
add_interface hps_io conduit end
set_interface_property hps_io EXPORT_OF hps_0.hps_io
add_interface input_sequence_0 conduit end
set_interface_property input_sequence_0 EXPORT_OF input_sequence_0.external_connection
add_interface inputsequences conduit end
set_interface_property inputsequences EXPORT_OF inputSequences.external_connection
add_interface mem_s2 avalon slave
set_interface_property mem_s2 EXPORT_OF two_port_mem.s2
add_interface memory conduit end
set_interface_property memory EXPORT_OF hps_0.memory
add_interface nextsample conduit end
set_interface_property nextsample EXPORT_OF nextSample.external_connection
add_interface preparingnextsample conduit end
set_interface_property preparingnextsample EXPORT_OF preparingNextSample.external_connection
add_interface ready_to_process conduit end
set_interface_property ready_to_process EXPORT_OF ready_to_process.external_connection
add_interface reset reset sink
set_interface_property reset EXPORT_OF clk_0.clk_in_reset
add_interface sequences_to_process conduit end
set_interface_property sequences_to_process EXPORT_OF sequences_to_process.external_connection
add_interface start_processing_chrom conduit end
set_interface_property start_processing_chrom EXPORT_OF start_processing_chrom.external_connection
add_interface startcomm conduit end
set_interface_property startcomm EXPORT_OF startComm.external_connection
add_interface valid_output_0 conduit end
set_interface_property valid_output_0 EXPORT_OF valid_output_0.external_connection
add_interface validoutputs conduit end
set_interface_property validoutputs EXPORT_OF validOutputs.external_connection
add_interface writesample conduit end
set_interface_property writesample EXPORT_OF writeSample.external_connection

set_interconnect_requirement {$system} qsys_mm.clockCrossingAdapter HANDSHAKE
set_interconnect_requirement {$system} qsys_mm.enableEccProtection FALSE
set_interconnect_requirement {$system} qsys_mm.insertDefaultSlave FALSE
set_interconnect_requirement {$system} qsys_mm.maxAdditionalLatency 1

save_system testeio.qsys
